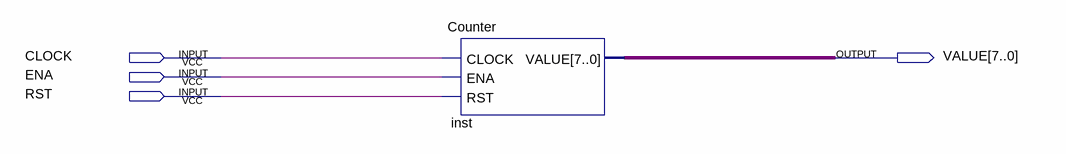
[diagram p0: schematic sheet]
// Quartus schematic Contatore.bdf as structural Verilog: 1 symbols, 4 pins
module Contatore (
  input  CLOCK,
  input  ENA,
  input  RST,
  output [7:0] VALUE
);

  Counter inst (.CLOCK(CLOCK), .ENA(ENA), .RST(RST), .VALUE(VALUE));
endmodule
